# Altium schematic sheet connectors_headers_LEDs.SchDoc
size A4; SheetNumber: 1; SheetTotal: 10; SPICEModelCacheXOLYCZGQ: <root> / <DocumentId>XOLYCZGQ</DocumentId> / <CacheFrame Number="0"> / <Model Name="3mm_151031vs04000" Kind="CKT"> / <Text>****** / .subckt 3mm_151031VS04000  1  2 / D1 1 2 TMRC / .MODEL TMRC D / + IS=10.010E-21 / + N=1.9467 / + RS=1.0000E-6 / + IKF=16.664E-3 / + CJO=1.0000E-12 / + M=.3333 / + VJ=.75 / + BV=5 / + IBV=10.00E-6 / + TT=5.0000E-9 / .ends</Text> / </Model> / <Model Name="3mm_151031ss04000" Kind="CKT"> / <Text>************************************************** / * Manufacturer:           Wurth Elektronik / * Kinds:                  THT Mono-color Round Color / * Matchcode:              WL-TMRC / * Library Type:           LTspice / * Version:                rev22a / * Created/modified by:    Ella / * Date and Time:          2022-02-23 / * Team:                   eiSos EDA Service / * Contact:                libraries@we-online.com / ************************************************** / * Copyright(C) 2022 WÃ¼rth Elektronik eiSos GmbH &amp; Co. KG / * All Rights Reserved. / ************************************************** / * Disclaimer: While WÃ¼rth Elektronik eiSos has made every reasonable effort to ensure the accuracy / * of the simulation models provided, WÃ¼rth Elektronik eiSos does not guarantee the exemption of error on / * the simulation models, nor does WÃ¼rth Elektronik eiSos guarantee that the simulation model is current. / * WÃ¼rth Elektronik eiSos reserves the right to make any adjustments at any time without notice. / * WÃ¼rth Elektronik eiSos expressly disclaims all implied warranties regarding this simulation model. / ************************************************** / .subckt 3mm_151031SS04000  1  2 / D1 1 2 TMRC / .MODEL TMRC D / + IS=10.010E-21 / + N=1.8860 / + RS=1.0000E-6 / + IKF=1.0000E3 / + CJO=1.0000E-12 / + M=.3333 / + VJ=.75 / + BV=5 / + IBV=10.00E-6 / + TT=5.0000E-9 / .ends</Text> / </Model> / </CacheFrame> / </root>
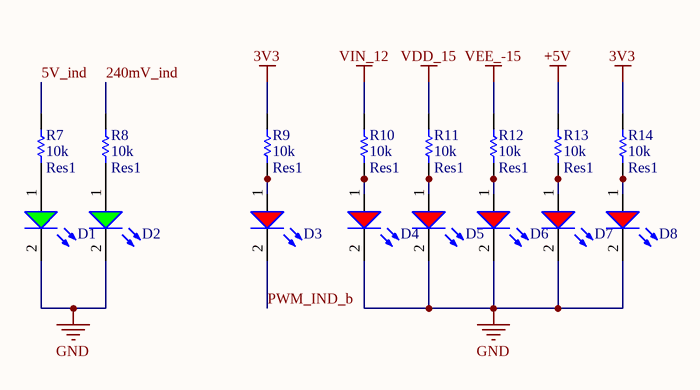
[diagram p0: connectors_headers_LEDs.SchDoc]

## Parts
D1  Bright Green, 2.1V, 40°  [WL-TMRC_D3.95H5.3]  (value not drawn)
D2  Bright Green, 2.1V, 40°  [WL-TMRC_D3.95H5.3]  (value not drawn)
D3  Super Red, 2V, 40°  [WL-TMRC_D3.95H5.3]  (value not drawn)
D4  Super Red, 2V, 40°  [WL-TMRC_D3.95H5.3]  (value not drawn)
D5  Super Red, 2V, 40°  [WL-TMRC_D3.95H5.3]  (value not drawn)
D6  Super Red, 2V, 40°  [WL-TMRC_D3.95H5.3]  (value not drawn)
D7  Super Red, 2V, 40°  [WL-TMRC_D3.95H5.3]  (value not drawn)
D8  Super Red, 2V, 40°  [WL-TMRC_D3.95H5.3]  (value not drawn)
R7  Res1  value 10k  [AXIAL-0.4]
R8  Res1  value 10k  [AXIAL-0.4]
R9  Res1  value 10k  [AXIAL-0.4]
R10  Res1  value 10k  [AXIAL-0.4]
R11  Res1  value 10k  [AXIAL-0.4]
R12  Res1  value 10k  [AXIAL-0.4]
R13  Res1  value 10k  [AXIAL-0.4]
R14  Res1  value 10k  [AXIAL-0.4]

## Nets
3V3: R9.2 R14.2
+5V: R13.2
GND: D1.2(K) D2.2(K) D4.2(K) D5.2(K) D6.2(K) D7.2(K) D8.2(K)
VDD_15: R11.2
VEE_-15: R12.2
VIN_12: R10.2
5V_ind: R7.2
240mV_ind: R8.2
PWM_IND_b: D3.2(K)
NetD1_1: D1.1(A) R7.1
NetD2_1: D2.1(A) R8.1
NetD3_1: D3.1(A) R9.1
NetD4_1: D4.1(A) R10.1
NetD5_1: D5.1(A) R11.1
NetD6_1: D6.1(A) R12.1
NetD7_1: D7.1(A) R13.1
NetD8_1: D8.1(A) R14.1

## Library data of the parts
D1 D2 = 151031VS04000: WL-TMRC Mono-color Round Color, THT, D3.95 x H5.3mm, Bright Green, 2.1V, 40°; Manufacturer: Wurth Elektronik; Case/Size Code: 3mm; Chip Technology: AlInGaP; Dominant Wavelength: 570nm; Luminous Intensity: 120mcd; Peak Wavelength: 573nm; Manufacturer Part Number: 151031VS04000; Category: Signal LEDs; Match Code: WL-TMRC; ComponentLink1Description: Website Link; ComponentLink1URL: https://www.we-online.com/redexpert/article/151031VS04000?ad; ComponentLink2Description: Datasheet Link; ComponentLink2URL: https://www.we-online.com/redexpert/spec/151031VS04000?ad; Mount: Through Hole; Operating Temperature Max: 85°C; Operating Temperature Min: -40°C; Packaging: Bulk; Height: 5.3mm; Diameter: 3.95mm; Emitting Color: Bright Green; Forward Voltage: 2.1V; Viewing Angle: 40°
D3-D8 = 151031SS04000: WL-TMRC Mono-color Round Color, THT, D3.95 x H5.3mm, Super Red, 2V, 40°; Manufacturer: Wurth Elektronik; Case/Size Code: 3mm; Chip Technology: AlInGaP; Dominant Wavelength: 635nm; Luminous Intensity: 160mcd; Peak Wavelength: 640nm; Manufacturer Part Number: 151031SS04000; Category: Signal LEDs; Match Code: WL-TMRC; ComponentLink1Description: Website Link; ComponentLink1URL: https://www.we-online.com/redexpert/article/151031SS04000?ad; ComponentLink2Description: Datasheet Link; ComponentLink2URL: https://www.we-online.com/redexpert/spec/151031SS04000?ad; Mount: Through Hole; Operating Temperature Max: 85°C; Operating Temperature Min: -40°C; Packaging: Bulk; Height: 5.3mm; Diameter: 3.95mm; Emitting Color: Super Red; Forward Voltage: 2V; Viewing Angle: 40°
R7-R14 = Res1: Resistor; Published: 8-Jun-2000; LatestRevisionDate: 17-Jul-2002; LatestRevisionNote: Re-released for DXP Platform.; PackageReference: AXIAL-0.3; Publisher: Altium Limited; PackageDescription: Axial Device, Thru-Hole; 2 Leads; 0.3 in Pin Spacing